# EAGLE design OpenChargeport (EAGLE 6.2)
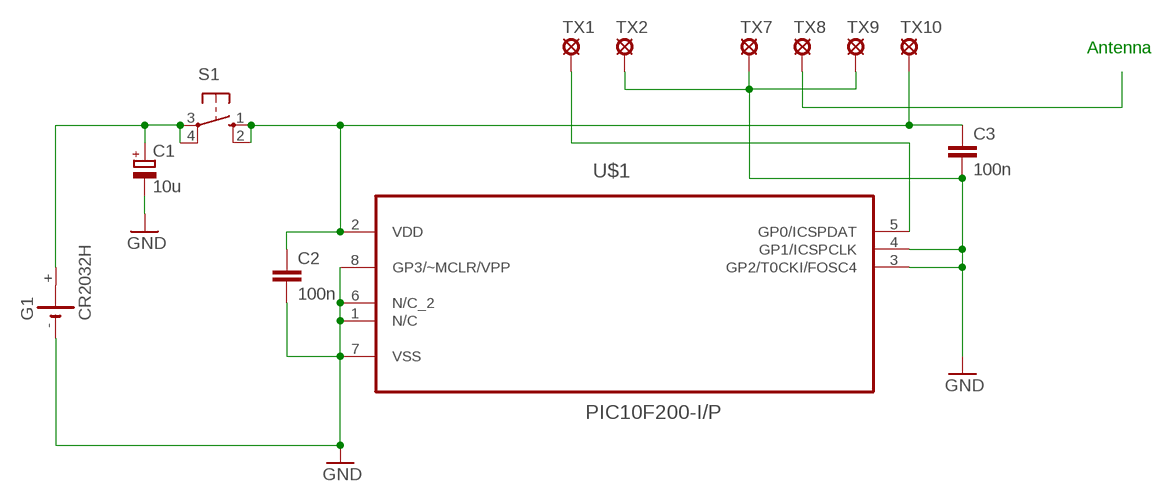
[diagram p0: schematic, sheet 1]

## Parts
C1  10u  CPOL-EUE2.5-5  [E2,5-5]
C2  100n  C-EU025-025X050  [C025-025X050]
C3  100n  C-EU025-025X050  [C025-025X050]
G1  CR2032H  [CR2032H]
S1  10-XX  [B3F-10XX]
TX1  LSP10  [LSP10]
TX2  LSP10  [LSP10]
TX7  LSP10  [LSP10]
TX8  LSP10  [LSP10]
TX9  LSP10  [LSP10]
TX10  LSP10  [LSP10]
U$1  PIC10F200-I/P  [DIP254P762X533-8]

## Nets
GND: C1.- C2.2 C3.2 G1.- TX2.MP TX7.MP TX9.MP U$1.1(N/C) U$1.3(GP2/T0CKI/FOSC4) U$1.4(GP1/ICSPCLK) U$1.6(N/C_2) U$1.7(VSS) U$1.8(GP3/~MCLR/VPP)
N$3: C1.+ G1.+ S1.3(P) S1.4(P1)
N$4: C2.1 C3.1 S1.1(S) S1.2(S1) TX10.MP U$1.2(VDD)
N$5: TX1.MP U$1.5(GP0/ICSPDAT)
N$6: TX8.MP
Unconnected: G1.+@1(+)

## Notes on the sheet
- Antenna

## Library data of the parts
C1 = rcl:CPOL-EU: POLARIZED CAPACITOR, European symbol
C2 C3 = rcl:C-EU: CAPACITOR, European symbol
G1 = battery:CR2032H: LI BATTERY Varta
S1 = switch-omron:10-XX: OMRON SWITCH; MPN: B3F-1000; OC_FARNELL: 176432; OC_NEWARK: 36M3542
TX1 TX2 TX7-TX10 = solpad:LSP10: SOLDER PAD drill 1.0 mm, distributor Buerklin, 12H555
U$1 = PIC10F200:PIC10F200-I/P: Microcontrollers; MPN: PIC10F200-I/P; OC_FARNELL: 1212714; OC_NEWARK: 96K3749; PACKAGE: DIP-8; SUPPLIER: Microchip

## Board
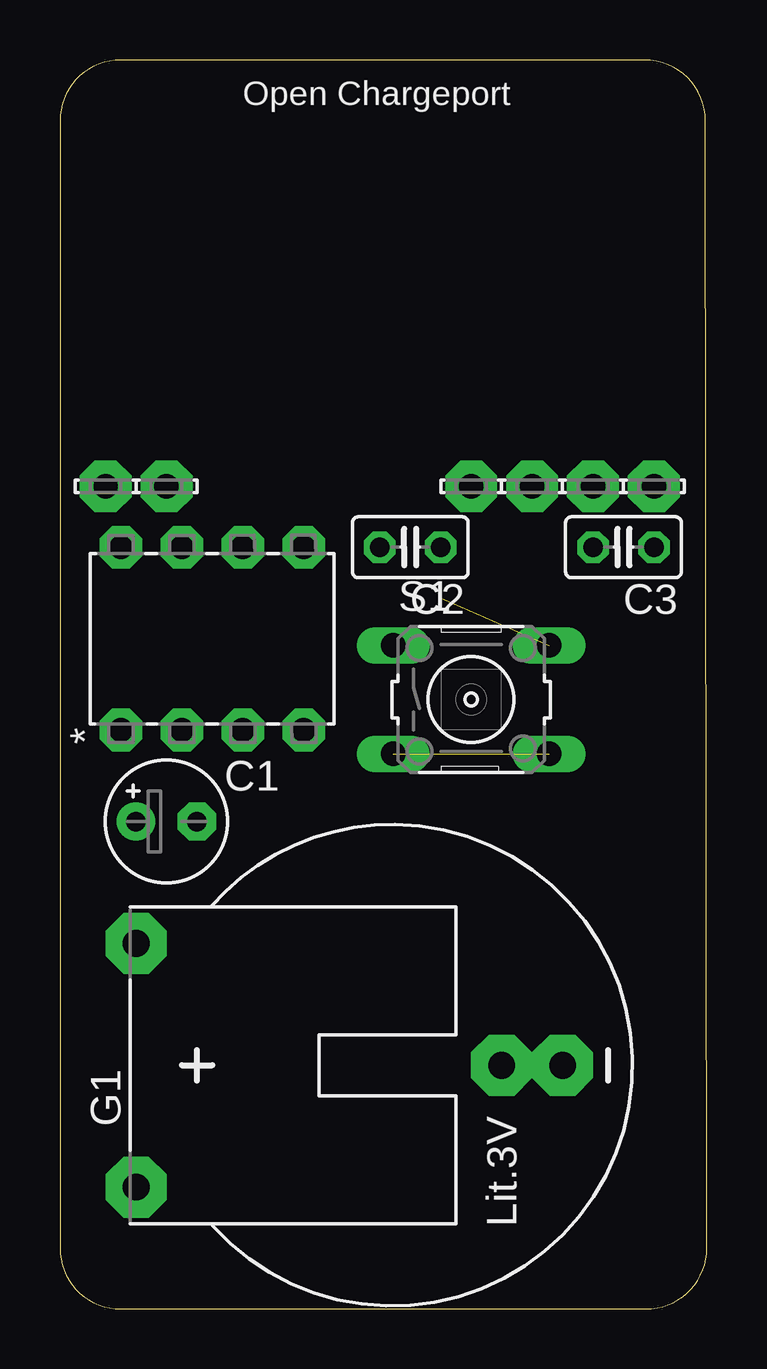
[diagram p1: board, top side]
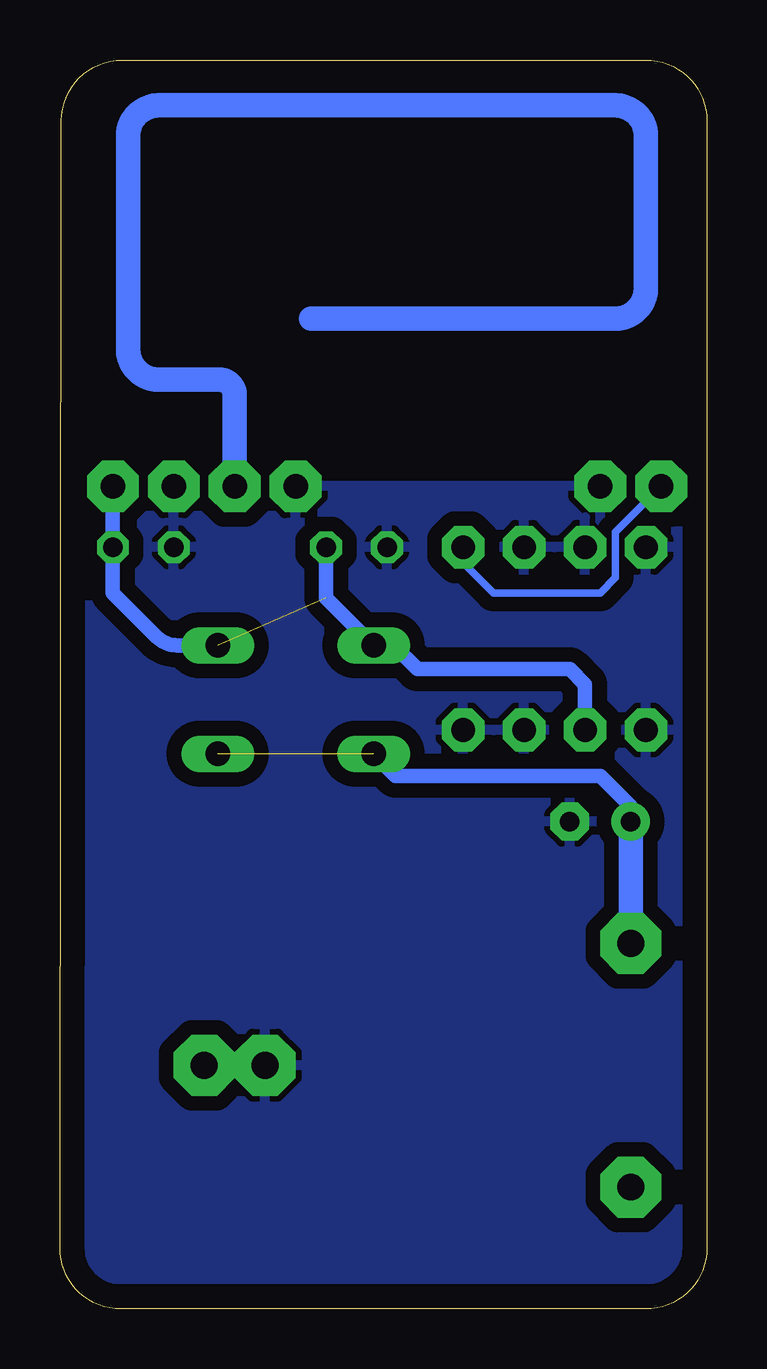
[diagram p2: board, bottom side, seen from below]

Size 26.97 x 52.06 mm. Coordinates in mm from the lower left corner, seen from the top.
Outline: 2.54,0 24.43,0 arc90 26.97,2.54 26.91,49.52 arc90 24.37,52.06 2.54,52.06 arc90 0,49.52 0,2.54 arc90 2.54,0
Copper layers (1*16): Top 0.035mm / dielectric 1.5mm / Bottom 0.035mm
Design rules: minimum track width 10mil, minimum drill 24mil, track to track 8mil, track to pad 8mil, pad to pad 8mil, via to via 8mil, smd to smd 8mil, copper to edge 40mil, drill to drill 8mil, minimum pad ring 10mil, minimum via ring 8mil, stop-mask expansion 4mil, vias tented up to drill 0mil, thermal gap 10mil

### Footprints (pad centres in the part's own frame; a part is rotated, then mirrored left to right if it is on the bottom)
E2,5-5 = drill 0.813 pad 1.6: + -1.27,0 | drill 0.813 pad 1.6 octagon: - 1.27,0
C025-025X050 = drill 0.813 octagon: 1 -1.27,0; 2 1.27,0
CR2032H = drill 1.118 pad 2.54 octagon: + 5.08,10.795; +@1 -5.08,10.795; - 0,-4.445; -1 0,-6.985
B3F-10XX = drill 1.016 long: 1 -3.251,2.261; 2 3.251,2.261; 3 -3.251,-2.261; 4 3.251,-2.261
LSP10 = drill 1.016 pad 2.159 octagon: MP 0,0
DIP254P762X533-8 = drill 0.991 pad 1.778 octagon: 1 -7.62,7.62; 2 -7.62,5.08; 3 -7.62,2.54; 4 -7.62,0; 5 0,0; 6 0,2.54; 7 0,5.08; 8 0,7.62

### Placement (x,y rotation side)
C1  4.45,20.32 0 top
C2  14.61,31.75 180 top
C3  23.5,31.75 180 top
G1  13.97,10.16 90 top
S1  17.14,25.4 0 top
TX1  1.91,34.29 0 top
TX2  4.45,34.29 0 top
TX7  17.14,34.29 0 top
TX8  19.68,34.29 0 top
TX9  22.23,34.29 0 top
TX10  24.77,34.29 0 top
U$1  10.16,31.75 90 top

### Tracks (layer width: path | path; a pad name or v marks a point on that pad's centre or on a via)
GND
  pour Bottom (isolate 0.61): 0,34.29 26.67,34.29 26.67,0 0,0
N$3  (1 unrouted)
  Bottom 0.61: C1.+ 3.17,20.95 4.45,22.23 12.98,22.23 S1.3
  Bottom 1.016: G1.+ C1.+
N$4  (1 unrouted)
  Bottom 0.61: TX10.MP C3.1 24.77,29.84 22.94,28.02 arc-45 22.08,27.66 S1.2 | C2.1 15.88,29.64 S1.1 13.06,27.66 12.06,26.67 5.71,26.67 5.08,26.04 U$1.2
N$5
  Bottom 0.305: U$1.5 10.16,31.11 8.89,29.84 4.45,29.84 3.81,30.48 3.81,32.38 TX1.MP
N$6
  Bottom 1.016: 16.51,41.27 3.81,41.27 arc-90 2.54,42.55 2.54,48.9 arc-90 3.81,50.16 22.86,50.16 arc-90 24.13,48.9 24.13,40.01 arc-90 22.86,38.73 20.32,38.73 arc90 19.68,38.1 TX8.MP

### Text on the board
tNames: Open Chargeport